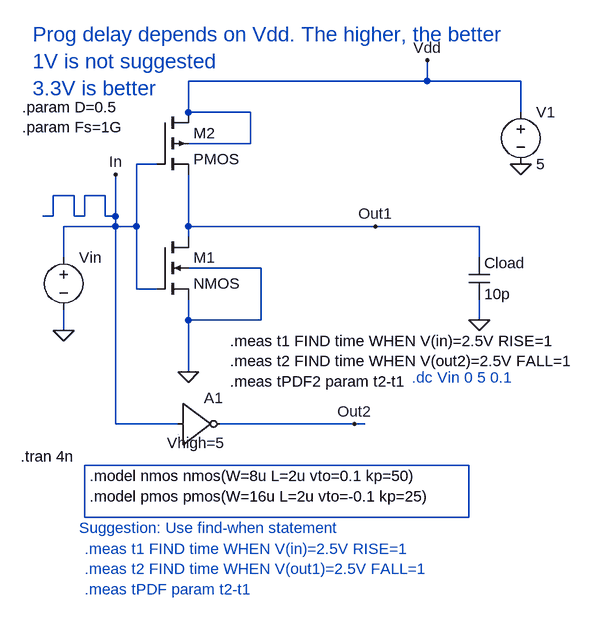
[diagram p0: schematic LogicGateInverter.asc]
LogicGateInverter.asc, the LTspice schematic file:
Version 4
SHEET 1 1800 776
WIRE 496 -16 496 -48
WIRE 496 -16 128 -16
WIRE 640 -16 496 -16
WIRE 128 32 128 -16
WIRE 224 32 128 32
WIRE 640 32 640 -16
WIRE 224 80 224 32
WIRE 224 80 128 80
WIRE 80 112 48 112
WIRE -48 160 -80 160
WIRE 0 160 -32 160
WIRE -80 192 -80 160
WIRE -80 192 -96 192
WIRE -48 192 -48 160
WIRE -32 192 -32 160
WIRE -32 192 -48 192
WIRE 0 192 0 160
WIRE 16 192 16 128
WIRE 16 192 0 192
WIRE 16 208 16 192
WIRE 16 208 -64 208
WIRE 48 208 48 112
WIRE 48 208 16 208
WIRE 128 208 128 128
WIRE 416 208 128 208
WIRE 576 208 416 208
WIRE 128 224 128 208
WIRE -64 256 -64 208
WIRE 576 256 576 208
WIRE 240 272 128 272
WIRE 48 304 48 208
WIRE 80 304 48 304
WIRE 128 352 128 320
WIRE 240 352 240 272
WIRE 240 352 128 352
WIRE 576 352 576 320
WIRE -64 368 -64 336
WIRE 128 432 128 352
WIRE 16 512 16 208
WIRE 112 512 16 512
WIRE 384 512 176 512
WIRE 400 512 384 512
WIRE 560 576 -32 576
WIRE -32 656 -32 576
WIRE 560 656 560 576
WIRE 560 656 -32 656
FLAG 640 112 0
FLAG 128 432 0
FLAG -64 368 0
FLAG 416 208 Out1
FLAG 384 512 Out2
FLAG 496 -48 Vdd
FLAG 576 352 0
FLAG 16 128 In
SYMBOL nmos4 80 224 R0
SYMATTR InstName M1
SYMBOL pmos4 80 32 R0
SYMATTR InstName M2
SYMBOL voltage 640 16 R0
SYMATTR InstName V1
SYMATTR Value 5
SYMBOL voltage -64 240 R0
WINDOW 3 24 96 Invisible 2
WINDOW 123 0 0 Left 0
WINDOW 39 0 0 Left 0
SYMATTR InstName Vin
SYMATTR Value PULSE(0 5 0 1f 1f {D/Fs} {1/Fs})
SYMBOL Digital\\inv 112 448 R0
WINDOW 3 -17 93 Left 2
SYMATTR InstName A1
SYMATTR Value Vhigh=5
SYMBOL cap 560 256 R0
SYMATTR InstName Cload
SYMATTR Value 10p
TEXT -112 -88 Left 3 ;Prog delay depends on Vdd. The higher, the better\n1V is not suggested\n3.3V is better
TEXT -128 24 Left 2 !.param D=0.5\n.param Fs=1G
TEXT -130 562 Left 2 !.tran 4n
TEXT 472 440 Left 2 ;.dc Vin 0 5 0.1
TEXT -24 592 Left 2 !.model nmos nmos(W=8u L=2u vto=0.1 kp=50)\n.model pmos pmos(W=16u L=2u vto=-0.1 kp=25)
TEXT -40 672 Left 2 ;Suggestion: Use find-when statement
TEXT -32 704 Left 2 ;.meas t1 FIND time WHEN V(in)=2.5V RISE=1\n.meas t2 FIND time WHEN V(out1)=2.5V FALL=1\n.meas tPDF param t2-t1
TEXT 192 384 Left 2 !.meas t1 FIND time WHEN V(in)=2.5V RISE=1\n.meas t2 FIND time WHEN V(out2)=2.5V FALL=1\n.meas tPDF2 param t2-t1

The netlist it stands for:
* LogicGateInverter.asc
M1 Out1 In 0 0 NMOS
M2 Vdd In Out1 Vdd PMOS
V1 Vdd 0 5
Vin In 0 PULSE(0 5 0 1f 1f {D/Fs} {1/Fs})
A1 In 0 0 0 0 Out2 0 0 BUF Vhigh=5
Cload Out1 0 10p
.model NMOS NMOS
.model PMOS PMOS
.lib standard.mos
* Prog delay depends on Vdd. The higher, the better
* 1V is not suggested
* 3.3V is better
.param D=0.5
.param Fs=1G
.tran 4n
* .dc Vin 0 5 0.1
.model nmos nmos(W=8u L=2u vto=0.1 kp=50)
.model pmos pmos(W=16u L=2u vto=-0.1 kp=25)
* Suggestion: Use find-when statement
* .meas t1 FIND time WHEN V(in)=2.5V RISE=1
* .meas t2 FIND time WHEN V(out1)=2.5V FALL=1
* .meas tPDF param t2-t1
.meas t1 FIND time WHEN V(in)=2.5V RISE=1
.meas t2 FIND time WHEN V(out2)=2.5V FALL=1
.meas tPDF2 param t2-t1
.backanno
.end